# Altium schematic sheet TEMPLATE_Title.SchDoc
size Tabloid; Date: Date; Author: Author 1; Revision: 1; SheetNumber: 3; SheetTotal: 3; Size: 11x17; Sheet_Name: Sheet Description
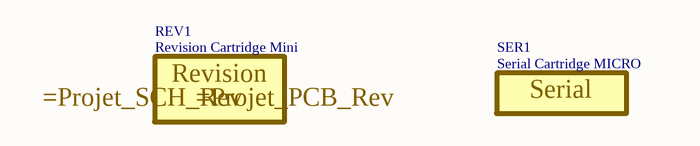
[diagram p0: TEMPLATE_Title.SchDoc]

## Parts
REV1  Revision Cartridge Mini  [REV_REVISION_CARTRIDGE_MINI]  (no BOM)
SER1  Serial Cartridge MICRO  [SER_SERIAL_CARTRIDGE_MICRO]  (no BOM)

## Notes on the sheet
- Projet initial
- Historique de révision
- 1.0
- Légende
- Conversion des boitiers
- Notes Générales
- Métrique
- 1005
- 1608
- Impérial
- 0402
- 0603
- Revision
- .
- Notes PCB
- 2012
- 3216
- 0805
- 1206
- Notes Programmation
- 3225
- 6432
- 1210
- 2512
- Date :
- Variants
- RÉVISION & NUMÉRO DE SÉRIE
- Titre du projet
- Cours associé au projet
- Taille
- Département
- Technologies du
- Révision
- PCB
- SCH
- Date
- génie électrique
- Feuille
- Variant
- de
- Concepteurs
- (in symbol CMP-008-000037-1) Revision; .
- (in symbol CMP-008-000042-1) Serial

## Library data of the parts
REV1 = CMP-008-000037-1: REV - REVISION CARTRIDGE MINI; SHOWDISTANCES: FALSE; NETSCOPE: AnyNet; LAYERKIND: SameLayer; VERTICALGAP: 0mil; UNIT: Imperial; RULEKIND: ComponentClearance; COLLISIONCHECKMODE: 3; Rule: UNIONINDEX=0; Value: *; Note: *; Source: CEGEP_SHERBROOKE_TGE_LIBRARY.SchLib; Package: *; Design Item ID: REV_REVISION_CARTRIDGE_MINI; GAP: 0mil; HelpURL: *; Manufacturer #1: *; Pin Count: 0; Component Type: Standard (No BOM); Power Max: *; Part Number #1: *; Polarized: *; Assembly Type: NONE
SER1 = CMP-008-000042-1: SER - SERIAL CARTRIDGE MICRO; COLLISIONCHECKMODE: 3; RULEKIND: ComponentClearance; SHOWDISTANCES: FALSE; Rule: UNIONINDEX=0; GAP: 0mil; NETSCOPE: AnyNet; UNIT: Imperial; LAYERKIND: SameLayer; HelpURL: *; Polarized: *; Source: CEGEP_SHERBROOKE_TGE_LIBRARY.SchLib; Value: *; Pin Count: 0; Design Item ID: SER_SERIAL_CARTRIDGE_MICRO; Package: *; Manufacturer #1: *; Component Type: Standard (No BOM); Assembly Type: NONE; Note: *; Power Max: *; VERTICALGAP: 0mil; Part Number #1: *